# EAGLE design chaoswest-token (EAGLE 6.6.0)
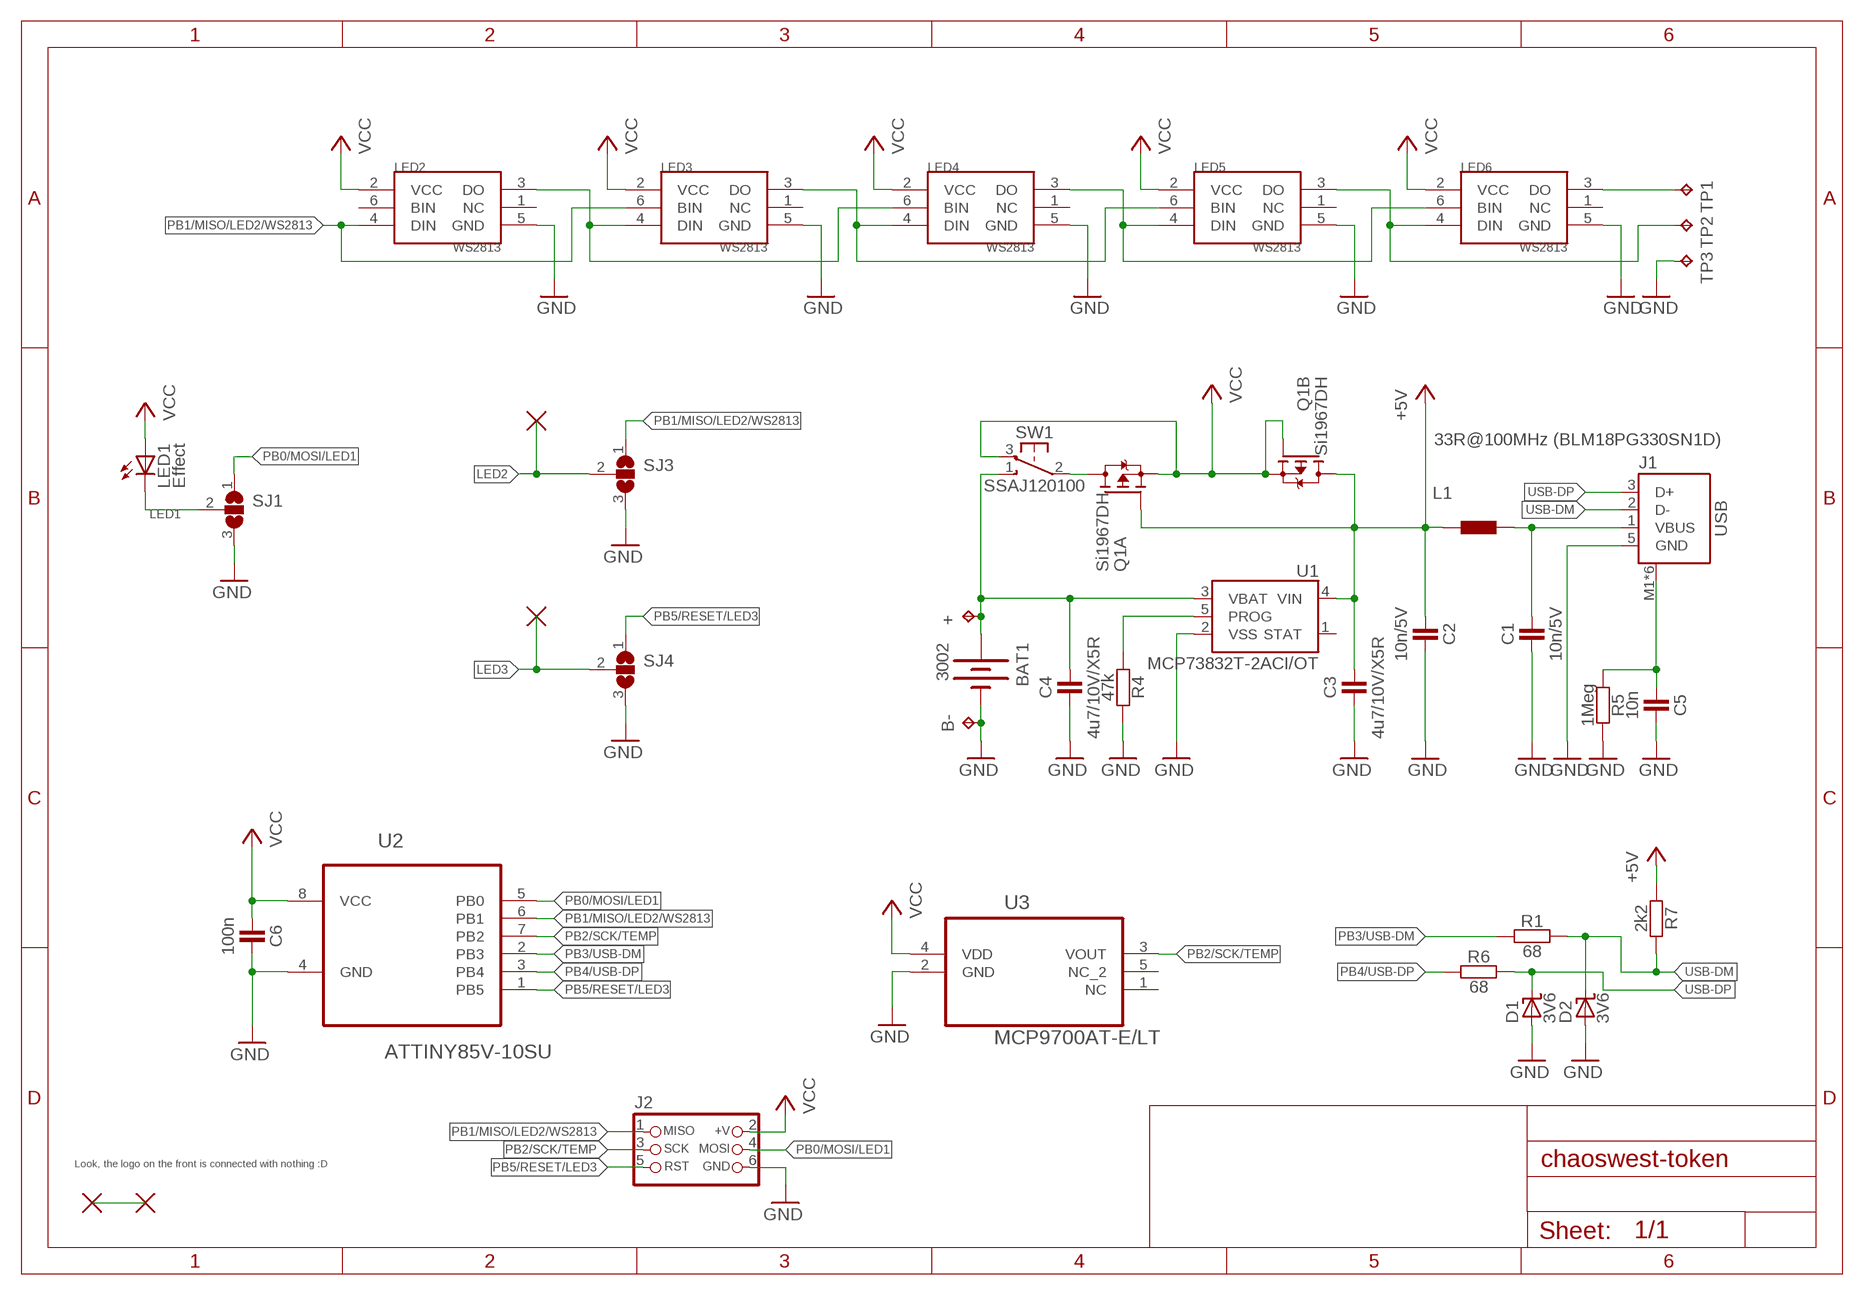
[diagram p0: schematic, sheet 1]

## Parts
+  TPTP18SQ  [TP18SQ]
B-  TPTP18SQ  [TP18SQ]
BAT1  3002  [BATTCON_20MM]
C1  10n/5V  CAPACITOR-0805  [C0805]
C2  10n/5V  CAPACITOR-0805  [C0805]
C3  4u7/10V/X5R  CAPACITOR-0805  [C0805]
C4  4u7/10V/X5R  CAPACITOR-0805  [C0805]
C5  10n  CAPACITOR-0805  [C0805]
C6  100n  CAPACITOR-0805  [C0805]
D1  3V6  D_ZENER-SOD123  [SOD123]
D2  3V6  D_ZENER-SOD123  [SOD123]
J1  USB  47346-0001  [MOLEX_47346-0001]
J2  ISP  CON_HEADER_PRG_AVR_ICSP-SMD  [M2X3_SMD]
L1  33R@100MHz (BLM18PG330SN1D)  INDUCTOR-0805  [C0805]
LED1  Effect  LED5MM  [LED5MM]
LED2  WS2813  [WS2813]
LED3  WS2813  [WS2813]
LED4  WS2813  [WS2813]
LED5  WS2813  [WS2813]
LED6  WS2813  [WS2813]
Q1  Si1967DH  BSS84AKS  [SOT363]
R1  68  RESISTOR-0805  [C0805]
R4  47k  RESISTOR-0805  [C0805]
R5  1Meg  RESISTOR-0805  [C0805]
R6  68  RESISTOR-0805  [C0805]
R7  2k2  RESISTOR-0805  [C0805]
SJ1  SJ2W  [SJ_2]
SJ3  SJ2W  [SJ_2]
SJ4  SJ2W  [SJ_2]
SW1  SSAJ120100  [SSAJ120100]
TP1  DO  TPTP09SQ  [TP09SQ]
TP2  BO  TPTP09SQ  [TP09SQ]
TP3  GND  TPTP09SQ  [TP09SQ]
U1  MCP73832T-2ACI/OT  MCP73831  [SOT23-5]
U2  ATTINY85V-10SU  [SOIC127P798X216-8N]
U3  MCP9700AT-E/LT  [SOT65P210X110-5N]
U$1  EMPTY_SIGNAL  [SMALLSPOT]
U$2  EMPTY_SIGNAL  [SMALLSPOT]
U$3  EMPTY_SIGNAL  [SMALLSPOT]
U$4  EMPTY_SIGNAL  [SMALLSPOT]

## Nets
+5V: C2.1 C3.1 L1.2 Q1.2(A:G) Q1.3(B:D) R7.2 U1.4(VIN)
GND: B-.TP BAT1.- C1.2 C2.2 C3.2 C4.2 C5.2 C6.2 D1.A D2.A J1.5(GND) J2.6(GND) LED2.5(GND) LED3.5(GND) LED4.5(GND) LED5.5(GND) LED6.5(GND) R4.1 R5.1 SJ1.3 SJ3.3 SJ4.3 TP3.TP U1.2(VSS) U2.4(GND) U3.2(GND)
LED1: LED1.K(C) SJ1.2
LED2: SJ3.2 U$3.X
LED3: SJ4.2 U$4.X
N$2: LED2.3(DO) LED3.4(DIN) LED4.6(BIN)
N$6: Q1.6(A:D) SW1.2(P1)
N$7: LED3.3(DO) LED4.4(DIN) LED5.6(BIN)
N$27: U$1.X U$2.X
N$28: R4.2 U1.5(PROG)
N$35: LED4.3(DO) LED5.4(DIN) LED6.6(BIN)
N$42: LED5.3(DO) LED6.4(DIN) TP2.TP
N$43: LED6.3(DO) TP1.TP
N$59: C5.1 J1.M1(SHIELD) J1.M2(SHIELD) J1.M3(SHIELD) J1.M4(SHIELD) J1.M5(SHIELD) J1.M6(SHIELD) R5.2
PB0/MOSI/LED1: J2.4(MOSI) SJ1.1 U2.5(PB0)
PB1/MISO/LED2/WS2813: J2.1(MISO) LED2.4(DIN) LED3.6(BIN) SJ3.1 U2.6(PB1)
PB2/SCK/TEMP: J2.3(SCK) U2.7(PB2) U3.3(VOUT)
PB3/USB-DM: R1.2 U2.2(PB3)
PB4/USB-DP: R6.2 U2.3(PB4)
PB5/RESET/LED3: J2.5(RST) SJ4.1 U2.1(PB5)
USB-DM: D2.C J1.2(D-) R1.1 R7.1
USB-DP: D1.C J1.3(D+) R6.1
VBAT: +.TP BAT1.+1(+) BAT1.+2(+) C4.1 SW1.1(S1) U1.3(VBAT)
VBUS: C1.1 J1.1(VBUS) L1.1
VCC: C6.1 J2.2(+V) LED1.A LED2.2(VCC) LED3.2(VCC) LED4.2(VCC) LED5.2(VCC) LED6.2(VCC) Q1.1(A:S) Q1.4(B:S) Q1.5(B:G) SW1.3(O1) U2.8(VCC) U3.4(VDD)
Unconnected: LED2.1(NC) LED2.6(BIN) LED3.1(NC) LED4.1(NC) LED5.1(NC) LED6.1(NC) U1.1(STAT) U3.1(NC) U3.5(NC_2)

## Notes on the sheet
- Look, the logo on the front is connected with nothing :D

## Library data of the parts
+ B- TP1-TP3 = testpad:TP: Test pad
BAT1 = extra:3002
C1-C6 = we-rcl:CAPACITOR: Capacitors ...2.2uF @ 6.3V -> 0402 ...4.7uF @ 6.3V -> 0603 ...10uF @ 16V -> 0805 ...22uF @ 25V -> 1206
D1 D2 = we-rcl:D_ZENER: Zener Diodes
J1 = Molex-47346-0001:47346-0001: CONN RCPT 5POS MICRO USB R/A SMD; MPN: 47346-0001; OC_FARNELL: 1568026; OC_NEWARK: 47M0505; PACKAGE: 5 POS MICRO USB R/A; SUPPLIER: MOLEX
J2 = dp_devices:CON_HEADER_PRG_AVR_ICSP: 2x3 AVR ICSP programming header
L1 = we-rcl:INDUCTOR: Inductors Ferrite Bead 0603 1.4A 220Ohm @ 100MH, -> Murata BLM18PG221SH1D 0603 1.0A 20Ohm @ 100MH -> Murata BLM18PG300SN1D
LED1 = led:LED: LED OSRAM: - CHIPLED LG R971, LG N971, LY N971, LG Q971, LY Q971, LO R971, LY R971 LH N974, LH R974 LS Q976, LO Q976, LY Q976 LO Q996 - Hyper CHIPLED LW Q18S LB Q993, LB Q99A, LB R99A - SideLED LS A670, LO A670, LY A670, LG A670, LP A670 LB A673, LV A673, LT A673, LW A673 LH A674 LY A675 LS A676, LA A676, LO A676, LY A676, LW A676 LS A679, LY A679, LG A679 - Hyper Micro SIDELED® LS Y876, LA Y876, LO Y876, LY Y876 LT Y87S - SmartLED LW L88C, LW L88S LB L89C, LB L89S, LG L890 LS L89K, LO L89K, LY L89K LS L896, LA L896, LO L896, LY L896 - TOPLED LS T670, LO T670, LY T670, LG T670, LP T670 LSG T670, LSP T670, LSY T670, LOP T670, LYG T670 LG T671, LOG T671, LSG T671 LB T673, LV T673, LT T673, LW T673 LH T674 LS T676, LA T676, LO T676, LY T676, LB T676, LH T676, LSB T676, LW T676 LB T67C, LV T67C, LT T67C, LS T67K, LO T67K, LY T67K, LW E67C LS E67B, LA E67B, LO E67B, LY E67B, LB E67C, LV E67C, LT E67C LW T67C LS T679, LY T679, LG T679 LS T770, LO T770, LY T770, LG T770, LP T770 LB T773, LV T773, LT T773, LW T773 LH T774 LS E675, LA E675, LY E675, LS T675 LS T776, LA T776, LO T776, LY T776, LB T776 LHGB T686 LT T68C, LB T68C - Hyper Mini TOPLED® LB M676 - Mini TOPLED Santana® LG M470 LS M47K, LO M47K, LY M47K Source: http://www.osram.convergy.de LUXEON: - LUMILED® LXK2-PW12-R00, LXK2-PW12-S00, LXK2-PW14-U00, LXK2-PW14-V00 LXK2-PM12-R00, LXK2-PM12-S00, LXK2-PM14-U00 LXK2-PE12-Q00, LXK2-PE12-R00, LXK2-PE12-S00, LXK2-PE14-T00, LXK2-PE14-U00 LXK2-PB12-K00, LXK2-PB12-L00, LXK2-PB12-M00, LXK2-PB14-N00, LXK2-PB14-P00, LXK2-PB14-Q00 LXK2-PR12-L00, LXK2-PR12-M00, LXK2-PR14-Q00, LXK2-PR14-R00 LXK2-PD12-Q00, LXK2-PD12-R00, LXK2-PD12-S00 LXK2-PH12-R00, LXK2-PH12-S00 LXK2-PL12-P00, LXK2-PL12-Q00, LXK2-PL12-R00 Source: www.luxeon.com KINGBRIGHT: KA-3528ASYC Source: www.kingbright.com
LED2-LED6 = extra:WS2813
Q1 = NXP-MOS:BSS84AKS
R1 R4-R7 = we-rcl:RESISTOR: Resistors all kinds in 0402 and 0603
SJ1 SJ3 SJ4 = jumper:SJ2W: SMD solder JUMPER
SW1 = extra:SSAJ120100
U1 = SparkFun:MCP73831: Microchip's MCP73831 Miniature single cell, fully integrated Li-Ion, Li-polymer charge management controller http://ww1.microchip.com/downloads/en/DeviceDoc/21984a.pdf
U2 = Atmel-ATTINY85V-10SU:ATTINY85V-10SU: 8-bit Microcontroller with In-System Programmable Flash; MPN: ATTINY85V-10SU; OC_FARNELL: 1455166; OC_NEWARK: 68T3816; PACKAGE: SOIC-8; SUPPLIER: Atmel
U3 = Microchip_By_element14_Batch_1:MCP9700AT-E/LT: IC, TEMP SNSR, ±1°C; MPN: MCP9700AT-E/LT; OC_FARNELL: 1332165; OC_NEWARK: 84R6272; PACKAGE: SC70-5; SUPPLIER: Microchip
U$1-U$4 = extra:EMPTY_SIGNAL

## Board
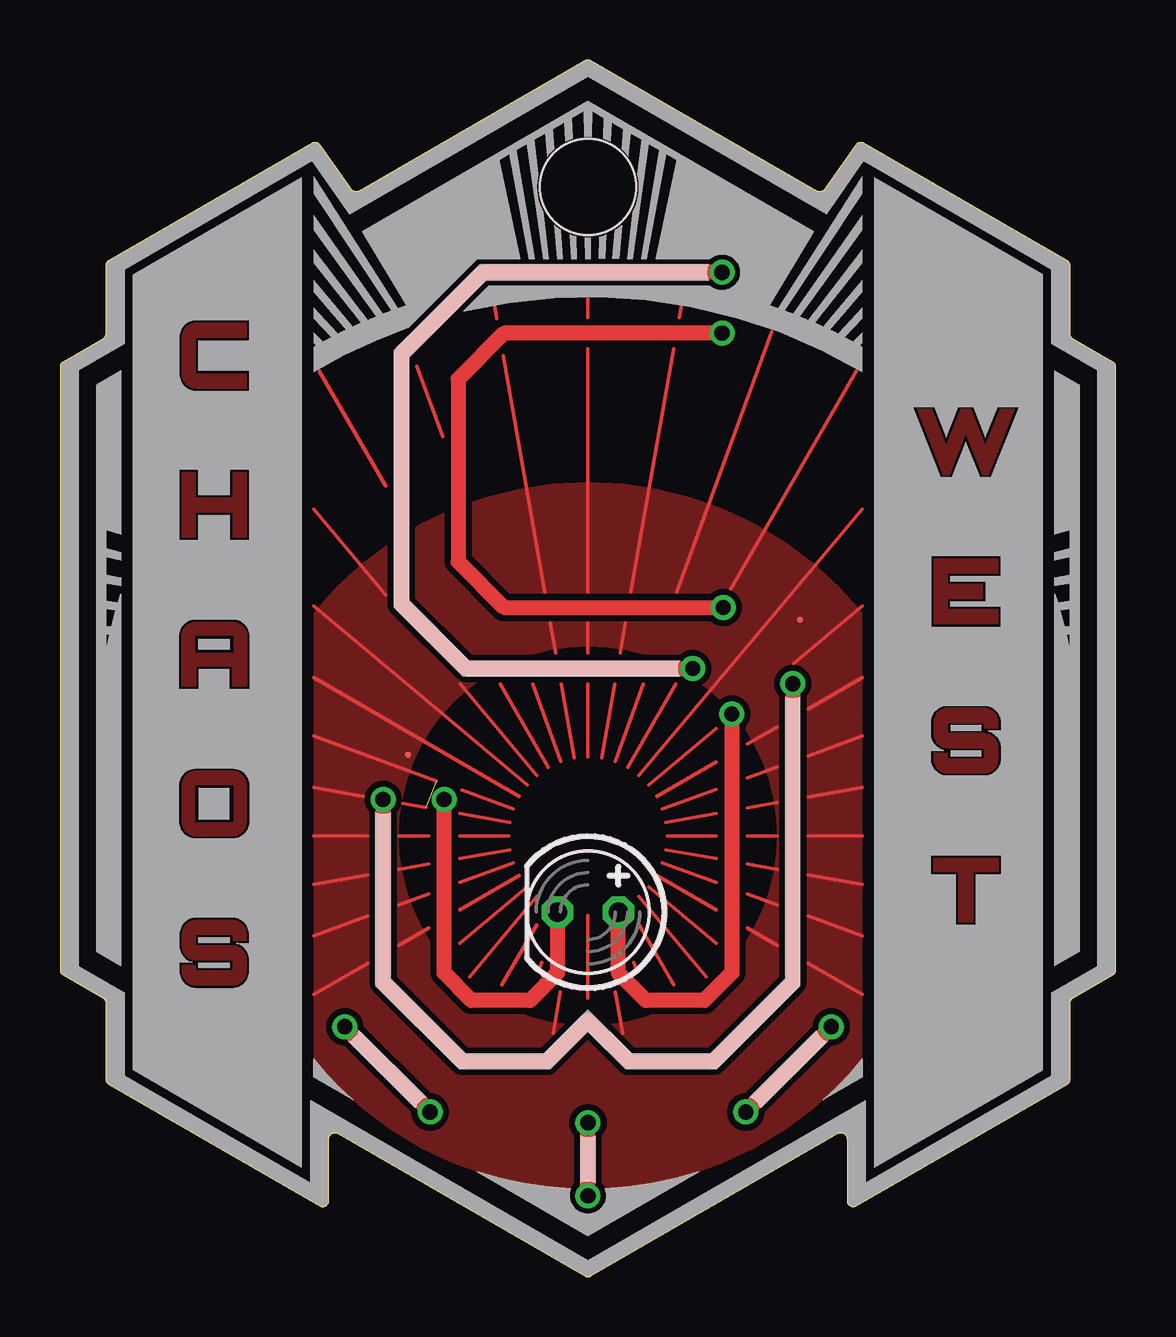
[diagram p1: board, top side]
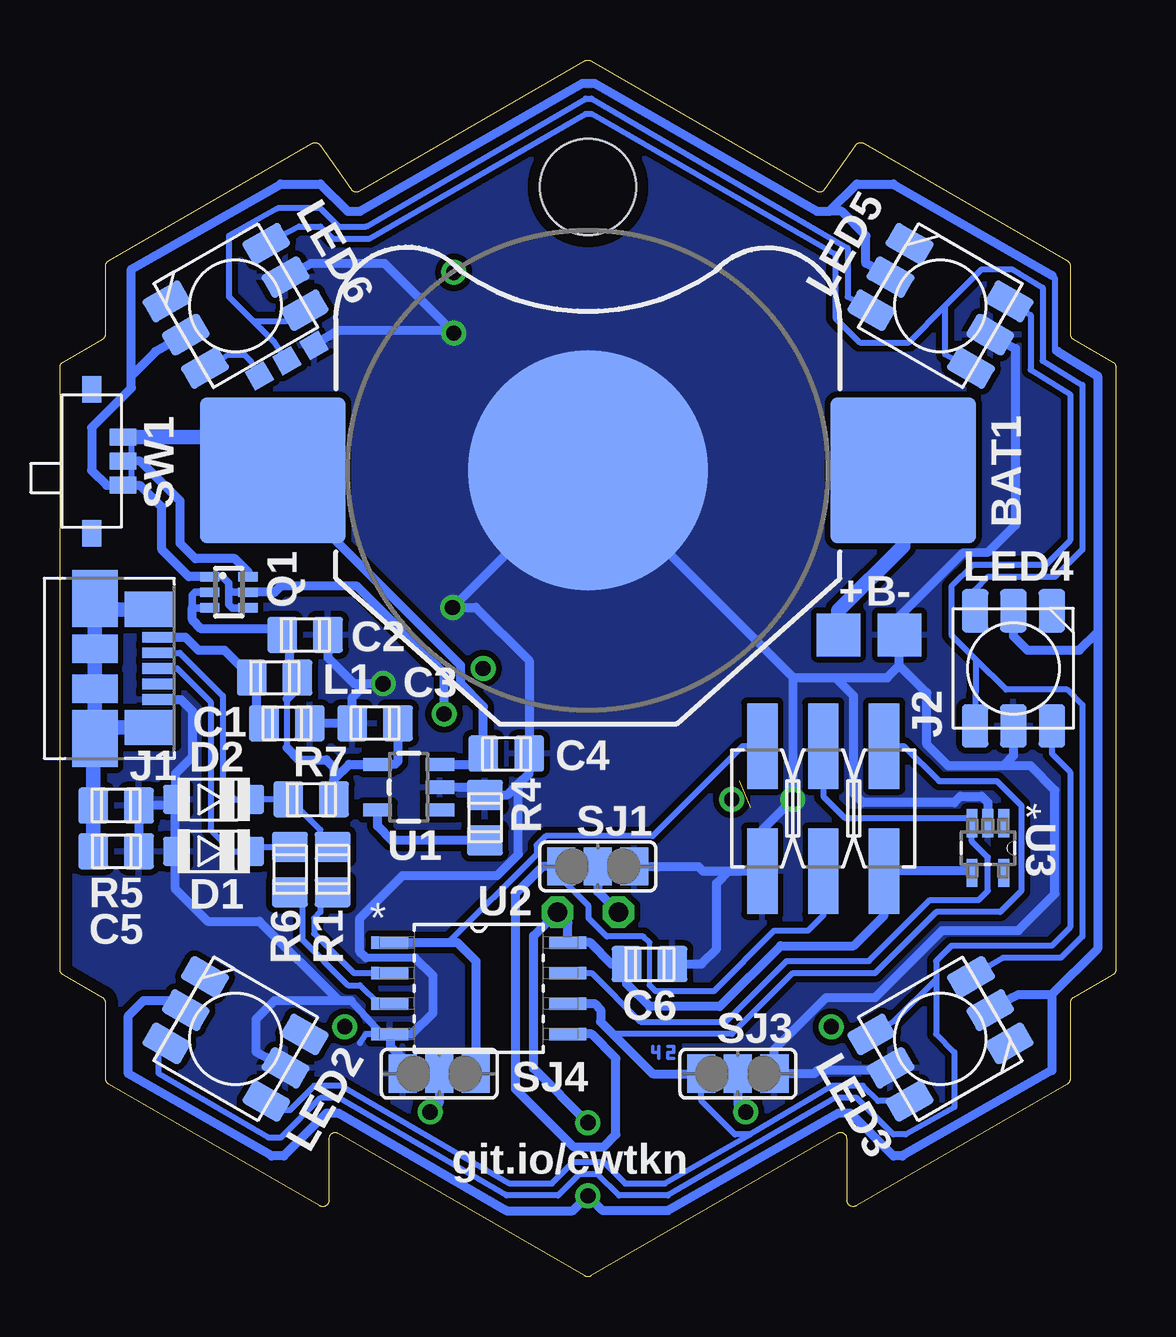
[diagram p2: board, bottom side, seen from below]

Size 43.99 x 50.72 mm. Coordinates in mm from the lower left corner, seen from the top.
Outline: 11.58,5.97 21.87,0.03 arc60 22.12,0.03 32.41,5.97 arc-120 32.79,5.75 32.79,3.18 arc120 33.17,2.96 41.96,8.03 arc60 42.09,8.25 42.09,11.41 arc-60 42.22,11.63 43.87,12.59 arc60 43.99,12.81 43.99,37.91 arc60 43.87,38.13 42.22,39.09 arc-60 42.09,39.31 42.09,42.14 arc60 41.96,42.36 33.49,47.25 arc85 33.16,47.17 31.87,45.33 arc-85 31.53,45.26 22.12,50.69 arc60 21.87,50.69 12.46,45.26 arc-85 12.13,45.33 10.84,47.17 arc85 10.5,47.25 2.03,42.36 arc60 1.91,42.14 1.91,39.31 arc-60 1.78,39.09 0.13,38.13 arc60 0,37.91 0,12.81 arc60 0.13,12.59 1.78,11.63 arc-60 1.91,11.41 1.91,8.25 arc60 2.03,8.03 10.82,2.96 arc120 11.2,3.18 11.2,5.75 arc-120 11.58,5.97
Copper layers (1*16): Top 0.035mm / dielectric 1.5mm / Bottom 0.035mm
Design rules "default *": minimum track width 6mil, minimum drill 24mil, track to track 8mil, track to pad 8mil, pad to pad 8mil, via to via 8mil, smd to smd 8mil, copper to edge 20mil, drill to drill 8mil, minimum pad ring 10mil, minimum via ring 8mil, stop-mask expansion 4mil, vias tented up to drill 0mil, thermal gap 10mil
Holes 4 mm at 22,45.43
Milling: 44 lines

### Footprints (pad centres in the part's own frame; a part is rotated, then mirrored left to right if it is on the bottom)
TP18SQ = smd 1.8 x 1.8: TP 0,0
BATTCON_20MM = smd 6.07 x 6.07: +1 -13.135,0; +2 13.135,0 | smd 10 x 10: - 0,0
C0805 = smd 1.5 x 1.25: 1 0,0.95; 2 0,-0.95
SOD123 = smd 1.2 x 1: A 0,-1.6; C 0,1.6
MOLEX_47346-0001 = smd 0.45 x 1.38: 1 -1.3,0; 2 -0.65,0; 3 0,0; 4 0.65,0; 5 1.3,0 | smd 1.475 x 2.1: M1 -2.462,-0.36; M2 2.462,-0.36 | smd 2.375 x 1.9: M3 -2.913,-2.66; M6 2.913,-2.66 | smd 1.175 x 1.9: M4 -0.82,-2.66; M5 0.85,-2.66
M2X3_SMD = smd 1.27 x 3.56: 1 -2.54,-2.605; 2 -2.54,2.605; 3 0,-2.605; 4 0,2.605; 5 2.54,-2.605; 6 2.54,2.605
LED5MM = drill 0.813 octagon: A -1.27,0; K 1.27,0
WS2813 = smd 1.8 x 1.1: 1 2.4,-1.6; 2 2.4,0; 3 2.4,1.6; 4 -2.4,1.6; 5 -2.4,0; 6 -2.4,-1.6
SOT363 = smd 0.4 x 0.8: 1 -0.65,-0.8; 2 0,-0.8; 3 0.65,-0.8; 4 0.65,0.8; 5 0,0.8; 6 -0.65,0.8
SJ_2 = smd 1.168 x 1.6: 1 -1.524,0; 2 0,0; 3 1.524,0
SSAJ120100 = smd 0.7 x 1.1: 1 -1,1.3; 2 0,1.3; 3 1,1.3 | smd 1.1 x 0.8: M$1 -3,0; M$2 3,0
TP09SQ = smd 0.9 x 0.9: TP 0,0
SOT23-5 = smd 0.55 x 1.2: 1 -0.95,-1.3; 2 0,-1.3; 3 0.95,-1.3; 4 0.95,1.3; 5 -0.95,1.3
SOIC127P798X216-8N = smd 1.549 x 0.533: 1 -3.708,1.905; 2 -3.708,0.635; 3 -3.708,-0.635; 4 -3.708,-1.905; 5 3.708,-1.905; 6 3.708,-0.635; 7 3.708,0.635; 8 3.708,1.905
SOT65P210X110-5N = smd 1.168 x 0.457: 1 -1.041,0.66; 2 -1.041,0; 3 -1.041,-0.66; 4 1.041,-0.66; 5 1.041,0.66
SMALLSPOT = smd 0.254 x 0.254: X 0,0

### Placement (x,y rotation side)
+  11.56,26.76 0 bottom
B-  9.02,26.76 0 bottom
BAT1  22,33.62 0 bottom
C1  34.54,23.07 90 bottom
C2  33.78,26.76 90 bottom
C3  30.86,23.07 270 bottom
C4  25.4,21.8 90 bottom
C5  41.66,17.74 90 bottom
C6  19.43,13.04 90 bottom
D1  37.59,17.74 270 bottom
D2  37.59,19.9 270 bottom
J1  39.88,25.36 270 bottom
J2  12.19,19.52 180 bottom
L1  35.05,24.98 90 bottom
LED1  22,15.2 180 top
LED2  36.68,9.92 150 bottom
LED3  7.32,9.92 30 bottom
LED4  4.27,25.36 90 bottom
LED5  7.32,40.47 150 bottom
LED6  36.68,40.47 210 bottom
Q1  36.96,28.54 270 bottom
R1  32.64,16.98 0 bottom
R4  26.29,19.14 0 bottom
R5  41.66,19.65 270 bottom
R6  34.42,16.98 0 bottom
R7  33.53,19.9 90 bottom
SJ1  21.59,17.11 0 bottom
SJ3  15.75,8.47 0 bottom
SJ4  28.19,8.47 180 bottom
SW1  42.67,34 270 bottom
TP1  35.69,37.55 30 bottom
TP2  34.54,38.19 30 bottom
TP3  33.4,38.82 30 bottom
U1  29.46,20.41 90 bottom
U2  26.54,12.03 0 bottom
U3  5.33,17.87 270 bottom
U$1  14.5,21.75 0 top
U$2  30.84,27.39 0 top
U$3  15.42,6.87 180 top
U$4  28.58,6.87 180 top

### Tracks (layer width: path | path; a pad name or v marks a point on that pad's centre or on a via)
+5V
  Bottom 0.241: 34.54,24.09 34.54,22.06
  Bottom 0.305: Q1.2 38.35,28.54 38.48,28.41 38.48,27.77 38.34,27.89 Q1.3
  Bottom 0.381: L1.2 34.42,25.29 34.42,26.38 34.73,26.69 C2.1 34.99,27.01 38.1,27.01 38.48,27.39 38.48,27.77 38.48,27.9 | R7.2 32.58,20.72 | 32.58,20.72 31.94,21.36 U1.4 30.04,21.36 29.91,21.48 C3.1 | L1.2 34.54,24.98 | L1.2 34.1,24.53 34.54,24.09 | 34.54,22.06 34.04,21.55 32.89,21.55 32.58,21.24 32.58,20.72
GND  (via drill 0.64)
  Top 0.635: v27.59,39.33 18.49,39.33 16.59,37.43 16.59,29.81 18.49,27.9 v27.64,27.9 | v30.53,24.73 30.53,12.28 27.23,8.98 23.7,8.98 22,10.68 20.29,8.98 16.77,8.98 13.46,12.28 v13.46,19.9
  Bottom 0.254: 31.5,9.74 31.24,10.12 30.86,10.12
  Bottom 0.305: 31.88,11.52 30.61,10.12
  Bottom 0.33: 29.21,13.3 31.24,13.3
  Bottom 0.356: 5.21,30.31 5.33,30.19 6.35,30.19
  Bottom 0.381: J1.5 38.96,24.06 38.48,23.58 38.48,21.68 39.19,20.97 D2.A | D2.A 39.45,19.65 R5.1 C5.2 | D2.A D1.A 39.19,16.17 37.85,14.82 35.69,14.82 32.38,11.52 | C1.2 C3.2 31.81,24.16 31.24,24.73 | U1.2 26.61,20.41 R4.1 25.34,20.09 24.89,20.53 | 24.89,20.53 24.45,20.98 C4.2 24.45,25.68 26.67,27.9 v27.64,27.9 22,33.54 | 22,33.54 BAT1.- 21.84,33.62 | U2.4 30.23,10.1 30.23,9.61 29.72,9.1 SJ4.3 | U2.4 29.34,10.12 28.45,11.01 28.45,12.53 29.21,13.3 | 31.24,13.3 31.5,13.55 31.5,14.95 29.72,16.72 25.78,16.72 24.89,17.61 24.89,20.53 | C2.2 32.83,25.81 31.75,24.73 31.24,24.73 | 31.24,24.73 v30.53,24.73 | 32.38,11.52 31.88,11.52 | 30.61,10.12 U2.4 | LED2.5 35.81,9.36 35.81,10.76 35.05,11.52 32.38,11.52 | LED3.5 9.51,8.6 12.45,8.6 12.57,8.47 SJ3.3 14.22,9.49 12.06,11.64 10.03,11.64 7.24,14.44 4.06,14.44 2.54,15.96 2.54,20.28 3.56,21.3 4.7,21.3 | LED5.5 4.19,38.7 4.19,31.33 5.21,30.31 | 6.35,30.19 9.02,27.52 B-.TP 9.02,25.49 | LED4.5 4.27,21.73 4.7,21.3 | 4.7,21.3 6.99,21.3 7.87,22.19 7.87,24.34 9.02,25.49 | TP3.TP 33.02,39.08 32.38,39.46 27.71,39.46 v27.59,39.33 27.59,39.36 30.48,42.25 33.53,42.25 LED6.5 | 22,33.54 13.44,24.98 | 13.44,24.98 11.68,24.98 | 11.68,24.98 9.53,24.98 9.02,25.49 | 13.44,24.98 13.44,19.92 v13.46,19.9 14.73,18.63 J2.6 16.13,16.91 | 11.68,24.98 10.92,24.22 10.92,20.15 10.54,19.77 6.73,19.77 6.48,20.03 5.59,20.03 5.33,19.77 U3.2 | SJ1.3 17.4,17.11 17.21,16.91 16.13,16.91 | C6.2 17.27,13.04 16.64,13.68 16.64,16.41 16.13,16.91
  pour Bottom (isolate 0.254): 0,-0.04 43.99,-0.04 43.99,50.76 0,50.76
LED1  (via drill 0.64)
  Top 0.635: LED1.K 20.73,12.66 19.58,11.52 17.15,11.52 16,12.66 v16,19.9
  Bottom 0.254: SJ1.2 20.45,17.11
  Bottom 0.381: SJ1.2 21.59,16.06 LED1.K
LED2  (via drill 0.64)
  Top 0.635: v11.86,10.43 U$3.X
  Bottom 0.254: SJ3.2 14.61,8.47
  Bottom 0.381: SJ3.2 15.75,7.2 U$3.X
  other vias: 15.42,6.87
LED3  (via drill 0.64)
  Top 0.635: U$4.X v32.13,10.43
  Bottom 0.254: SJ4.2 29.46,8.47
  Bottom 0.381: SJ4.2 28.19,7.25 U$4.X
  other vias: 28.58,6.87
N$2
  Bottom 0.254: LED4.6 2.67,21.8 1.91,21.04 1.91,14.57 2.67,13.8 6.86,13.8 7.49,13.17 7.49,12.41 | 7.49,12.41 9.27,10.63 LED3.4 | 7.49,12.41 7.49,10.12 6.73,9.36 6.73,7.07 8.76,5.93 9.27,5.93 10.79,7.45 11.68,7.45 18.67,3.39 20.7,3.39 21.59,4.28 22.35,4.28 23.24,3.39 25.4,3.39 32.38,7.45 33.15,7.45 34.8,5.8 35.31,5.8 39.88,8.47 39.88,9.41 LED2.3
N$3  (via drill 0.64)
  Top 0.635: v27.59,41.87 17.63,41.87 14.22,38.47 14.22,28.05 16.92,25.36 v26.37,25.36
N$4
  Bottom 0.152: 19.05,9.61 19.05,9.36 | 19.05,9.36 19.3,9.36 19.3,9.61 | 19.05,9.36 19.05,9.1
N$6
  Bottom 0.254: 41.02,33.23 41.02,33.97 SW1.2
  Bottom 0.381: Q1.6 36.16,29.39 36.7,29.93 38.35,29.93 38.99,30.57 38.99,32.35 40.64,34 SW1.2
N$7
  Bottom 0.254: LED5.6 3.56,40.09 3.56,37.81 1.91,36.79 1.91,30.69 2.92,29.68 5.97,29.68 6.86,28.79 6.86,26.76 5.84,25.74 | 5.84,25.74 LED4.4 | LED3.3 4.7,13.3 2.29,13.3 1.4,14.18 1.4,23.84 2.03,24.47 4.57,24.47 5.84,25.74
N$11
  pour Top: 7.77,39.16 7.77,39.74 5.66,39.74 arc90 5.08,39.16 5.08,37.64 arc90 5.66,37.05 7.77,37.05 7.77,37.64 5.66,37.64 5.66,39.16
N$12
  pour Top: 7.77,30.83 7.77,33.52 7.19,33.52 7.19,32.47 5.66,32.47 5.66,33.52 5.08,33.52 5.08,30.83 5.66,30.83 5.66,31.88 7.19,31.88 7.19,30.83
N$13
  pour Top: 5.08,24.61 5.08,26.71 arc-90 5.66,27.3 7.19,27.3 arc-90 7.77,26.71 7.77,24.61 7.19,24.61 7.19,25.44 5.66,25.44 5.66,24.61
N$14
  cutout Top: 5.66,26.03 5.66,26.71 7.19,26.71 7.19,26.03
N$15
  cutout Top: 5.66,18.97 5.66,20.49 arc-90 5.66,20.49 7.19,20.49 7.19,18.97
N$16
  pour Top: 5.08,20.49 5.08,18.97 arc90 5.66,18.38 7.19,18.38 arc90 7.77,18.97 7.77,20.49 arc90 7.19,21.08 5.66,21.08 arc90
N$17
  pour Top: 7.19,14.03 7.77,14.03 7.77,14.27 arc90 7.19,14.85 5.66,14.85 arc90 5.08,14.27 5.08,13.8 arc90 5.66,13.21 7.19,13.21 7.19,12.74 5.66,12.74 5.66,12.98 5.08,12.98 5.08,12.74 arc90 5.66,12.16 7.19,12.16 arc90 7.77,12.74 7.77,13.21 arc90 7.19,13.8 5.66,13.8 5.66,14.27 7.19,14.27
N$18
  pour Top: 35.71,36.14 36.79,33.45 37.07,33.45 37.75,35.13 38.42,33.45 38.7,33.45 39.78,36.14 39.15,36.14 38.56,34.67 37.97,36.14 37.52,36.14 36.93,34.67 36.34,36.14
N$19
  pour Top: 39.09,29.91 36.4,29.91 36.4,27.22 39.09,27.22 39.09,27.81 36.98,27.81 36.98,28.28 38.46,28.28 38.46,28.86 36.98,28.86 36.98,29.33 39.09,29.33
N$20
  pour Top: 36.98,21 38.51,21 arc90 39.09,21.58 39.09,22.05 arc90 38.51,22.64 36.98,22.64 36.98,23.11 38.51,23.11 38.51,22.87 39.09,22.87 39.09,23.11 arc90 38.51,23.69 36.98,23.69 arc90 36.4,23.11 36.4,22.64 arc90 36.98,22.05 38.51,22.05 38.51,21.58 36.98,21.58 36.98,21.82 36.4,21.82 36.4,21.58 arc90
N$21
  pour Top: 36.4,17.47 39.09,17.47 39.09,16.88 38.04,16.88 38.04,14.78 37.45,14.78 37.45,16.88 36.4,16.88
N$22
  Bottom 0.152: 18.67,9.61 18.41,9.61 18.41,9.36 18.67,9.36 18.67,9.1 18.41,9.1
N$26
  cutout Top: 29.87,18.38 arc180 14.12,18.38 arc180
N$27  (1 unrouted)
  Top 0.152: 13.58,28.41 10.57,32 | 20.55,10.15 20.85,11.87 | 23.14,11.87 23.45,10.15 | 28.64,14.54 29.88,13.82 | 31.18,13.07 33.43,11.78 | 28.64,15.96 29.88,15.5 | 31.18,15.03 33.43,14.22 | 28.64,17.2 29.88,16.98 | 31.18,16.76 33.43,16.36 | 31.18,18.38 33.43,18.38 | 28.64,18.38 29.88,18.38 | 28.64,19.55 29.88,19.77 | 31.18,19.99 33.43,20.39 | 31.18,21.72 33.43,22.54 | 28.64,20.79 29.88,21.25 | 28.64,22.21 29.88,22.93 | 31.18,23.68 33.43,24.97 | 30.56,25.56 33.43,27.97 | 24.12,20.9 30.03,27.94 33.43,32 | 27.95,28.68 33.19,37.75 | 25.7,28.55 29.65,39.4 | 23.79,28.55 25.58,38.68 | 23.34,26.01 23.56,27.25 | 22,26.01 22,27.25 | 22,28.55 22,38.68 | 20.2,28.55 18.47,38.39 | 20.65,26.01 20.43,27.25 | 19.88,20.9 16.68,24.71 | 19.47,20.5 14.9,24.33 10.57,27.97 | 10.57,11.78 12.81,13.07 | 10.57,14.22 12.81,15.03 | 14.11,13.82 15.36,14.54 | 14.11,15.5 15.36,15.96 | 14.11,16.98 15.36,17.2 | 10.57,16.36 12.81,16.76 | 10.57,18.38 12.81,18.38 | 14.11,18.38 15.36,18.38 | 14.29,19.74 15.23,19.57 | 10.57,20.39 12.63,20.03 | 10.57,22.54 15.68,20.67 | 19.14,20.03 10.57,24.97
  pour Top (isolate 0.254): 33.43,27.67 arc102 10.57,27.67 10.57,9.08 arc102 33.43,9.08
N$28
  Bottom 0.381: R4.2 30.16,18.19 30.76,18.79 U1.5
N$32
  Top 0.152: 24.02,12.83 23.91,13.11
N$34
  Top 0.152: 24.14,14.67 25.58,12.17
N$35
  Bottom 0.254: LED5.4 6.08,37.93 6.22,37.93 7.11,38.44 7.11,40.47 | 7.11,40.47 5.59,42 4.32,42 3.05,41.24 3.05,38.19 1.4,37.17 1.4,30.31 2.54,29.17 5.33,29.17 5.87,28.64 LED4.3 | 7.11,40.47 8.64,38.95 10.67,38.95 11.68,39.97 11.68,42.63 21.84,48.47 22.1,48.47 31.11,43.27 32.64,43.27 33.15,43.78 34.04,43.78 LED6.6
N$37
  Top 0.152: 26.92,12.51 24.12,15.85
N$39
  Top 0.152: 24.53,16.25 27.34,13.89
N$41
  Top 0.152: 24.86,16.72 27.34,15.29
N$42
  Bottom 0.254: LED5.3 11.18,40.85 11.18,42.89 21.84,49.11 22.1,49.11 31.24,43.78 32.38,43.78 33.15,44.54 34.92,44.54 36.96,43.39 36.96,40.85 35.94,39.84 | 35.94,39.84 34.54,39.84 LED6.4 | TP2.TP 35.05,38.95 35.94,39.84
N$43
  Bottom 0.254: LED6.3 36.96,38.44 36.32,38.44 36.07,38.19 TP1.TP
N$44
  Top 0.152: 25.1,17.25 27.34,16.43
N$47
  Top 0.152: 25.25,17.8 27.34,17.43
N$50
  Top 0.152: 25.3,18.38 27.34,18.38
N$53
  Top 0.152: 25.25,18.95 27.34,19.32
N$56
  Top 0.152: 25.1,19.5 27.34,20.32
N$59
  Bottom 0.61: J1.M1 42.09,27.82 J1.M3 J1.M4 J1.M5 J1.M6 | J1.M2 42.09,22.9 J1.M6 | J1.M6 42.61,22.38 R5.2 C5.1
N$61
  Top 0.152: 24.86,20.03 27.34,21.46
N$63
  Top 0.152: 24.53,20.5 27.34,22.86
N$65
  Top 0.152: 23.65,21.24 25.66,24.71
N$67
  Top 0.152: 23.13,21.48 24.3,24.71
N$69
  Top 0.152: 22.57,21.63 23.11,24.71
N$72
  Top 0.152: 25.81,39.98 25.88,40.41
N$74
  Top 0.152: 22,21.68 22,24.71
N$76
  Top 0.152: 22,39.98 22,40.75
N$78
  Top 0.152: 21.42,21.63 20.88,24.71
N$80
  Top 0.152: 18.19,39.95 18.11,40.41
N$81
  Top 0.152: 13.58,32.96 10.81,37.75
N$82
  Top 0.152: 15.94,35.02 14.87,37.95
N$83
  Top 0.152: 20.87,21.48 19.69,24.71
N$84
  Top 0.152: 20.35,21.24 18.34,24.71
N$90
  Top 0.152: 16.75,20.29 18.89,19.5
N$94
  Top 0.152: 16.65,19.32 18.75,18.95
N$95
  Top 0.152: 16.65,18.38 18.7,18.38
N$100
  Top 0.152: 16.65,17.43 18.75,17.8
N$101
  Top 0.152: 16.65,16.43 18.89,17.25
N$106
  Top 0.152: 16.65,15.29 19.14,16.72
N$107
  Top 0.152: 16.65,13.89 19.47,16.25
N$110
  Top 0.152: 17.07,12.51 19.88,15.85
N$111
  Top 0.152: 22,11.6 22,15.07
N$115
  Top 0.152: 18.41,12.17 19.86,14.67
N$117
  Top 0.152: 19.98,12.83 20.08,13.11
PB0/MOSI/LED1
  Bottom 0.203: 19.43,12.15 19.43,13.93
  Bottom 0.254: 19.43,12.15 19.18,11.9 16.76,11.9 14.22,14.44 12.83,14.44 12.19,15.07 J2.4 | 19.43,13.93 19.68,14.18 21.21,14.18 21.97,14.95 21.97,15.45 23.11,16.6 SJ1.1
  Bottom 0.381: SJ1.1 23.88,17.11 25.02,15.96 25.02,7.83 22.61,5.42 21.34,5.42 20.83,5.93 20.83,9.1 21.84,10.12 U2.5
PB1/MISO/LED2/WS2813
  Bottom 0.254: LED3.6 9.91,7.33 10.54,7.96 11.81,7.96 15.24,5.93 | 15.24,5.93 15.88,5.93 17.27,7.33 SJ3.1 | 15.24,5.93 18.8,3.9 20.45,3.9 21.34,4.79 22.61,4.79 23.5,3.9 25.27,3.9 32.26,7.96 33.4,7.96 34.42,6.95 35.01,6.95 LED2.4 | 20.95,10.12 16,10.12 13.46,12.66 10.03,12.66 7.49,15.2 4.83,15.2 3.94,16.09 3.94,19.65 4.95,20.66 7.37,20.66 8.83,22.12 J2.1
  Bottom 0.381: U2.6 21.72,11.39 21.46,11.14 21.46,10.63 20.95,10.12 19.3,8.47 SJ3.1
PB2/SCK/TEMP
  Bottom 0.254: U2.7 21.84,12.66 19.81,10.63 16.26,10.63 13.72,13.17 10.29,13.17 7.75,15.71 5.71,15.71 5.33,16.09 5.33,17.49 5.99,18.15 U3.3 6.22,19.14 11.3,19.14 12.19,20.03 J2.3
PB3/USB-DM
  Bottom 0.254: R1.2 33.15,15.52 33.15,15.2 33.4,14.95 33.4,14.31 31.75,12.66 U2.2
PB4/USB-DP
  Bottom 0.254: R6.2 33.91,15.52 33.91,14.06 32.13,12.28 32,12.15 31.5,12.15 30.73,11.39 U2.3
PB5/RESET/LED3
  Bottom 0.254: 27.81,13.93 24.13,17.61 24.13,17.99 23.75,18.38 19.3,18.38 15.56,22.12 J2.5
  Bottom 0.381: U2.1 27.81,13.93 27.43,13.93 26.67,13.17 SJ4.1
USB-DM
  Bottom 0.254: J1.2 39,26.01 37.21,24.22 37.21,20.41 36.7,19.9 D2.C R7.1 34.42,19.9 33.15,18.63 33.15,18.44 R1.1
USB-DP
  Bottom 0.254: J1.3 39.12,25.36 37.72,23.96 37.72,18.63 36.83,17.74 D1.C 35.8,17.93 R6.1
VBAT
  Bottom 0.254: 41.02,34.25 41.02,34.97 SW1.1
  Bottom 0.381: BAT1.+1 35.13,33.31 27.3,25.49 27.3,24.73 26.35,23.77 C4.1 26.8,21.36 U1.3
  Bottom 0.61: BAT1.+1 36.51,35 SW1.1 | +.TP 11.56,27.77 8.86,30.47 BAT1.+2
VBUS
  Bottom 0.381: J1.1 38.77,26.66 38.23,26.12 37.15,26.12 L1.1 35.81,24.79 35.81,23.33 C1.1
VCC  (via drill 0.64)
  Top 0.635: v27.99,23.46 27.99,12.66 26.85,11.52 24.41,11.52 23.27,12.66 LED1.A | v22,3.38 v22,6.42
  Bottom 0.254: 2.67,41.74 2.54,41.62 2.54,38.57 2.41,38.57
  Bottom 0.305: Q1.1 37.23,29.19 36.96,28.92 36.96,28.66 | 36.96,28.66 36.83,28.54 Q1.5 | Q1.4 36.81,27.89 36.96,28.03 36.96,28.66
  Bottom 0.381: Q1.1 38.62,29.19 39.75,30.31 39.75,32.09 40.64,32.98 41.36,32.98 SW1.3 42.05,33 42.67,33.62 42.67,35.39 41.02,37.04 41.02,37.55 | v27.99,23.46 27.99,25.16 31.62,28.79 34.8,28.79 35.05,28.54 Q1.5 | v22,6.42 24.26,8.68 24.26,14.21 LED1.A 22.84,14.77 U2.8 21.91,13.93 21.02,13.04 C6.1 20.38,12.21 19.43,11.26 16.51,11.26 13.97,13.8 10.92,13.8 9.65,15.07 J2.2 6.08,16.91 U3.4 | 2.67,41.74 9.27,45.55 10.79,45.55 11.94,44.41 | 2.41,38.57 0.76,37.55 0.76,26.88 | 0.76,26.88 0.76,13.68 2.67,11.77 | 2.67,11.77 2.67,8.6 8.89,5.04 9.27,5.04 11.05,6.82 11.56,6.82 18.67,2.75 21.38,2.75 v22,3.38 22.62,2.75 25.4,2.75 32.38,6.82 32.89,6.82 34.67,5.04 35.18,5.04 41.15,8.47 41.15,10.88 40.51,11.52 39.16,11.52 LED2.2 | LED4.2 4.27,26.71 3.68,26.12 1.52,26.12 0.76,26.88 | 11.94,44.41 12.45,44.41 21.72,49.74 22.23,49.74 31.5,44.41 32,44.41 33.15,45.55 34.8,45.55 41.02,42 41.02,37.55 | LED5.2 10.41,42.25 10.41,43.39 11.43,44.41 11.94,44.41 | LED3.2 4.32,11.64 4.06,11.77 2.67,11.77 | LED6.2 40.01,38.57 41.02,37.55

### Text on the board
bNames: git.io/cwtkn